# Altium schematic sheet MCUSetup.SchDoc
size A4
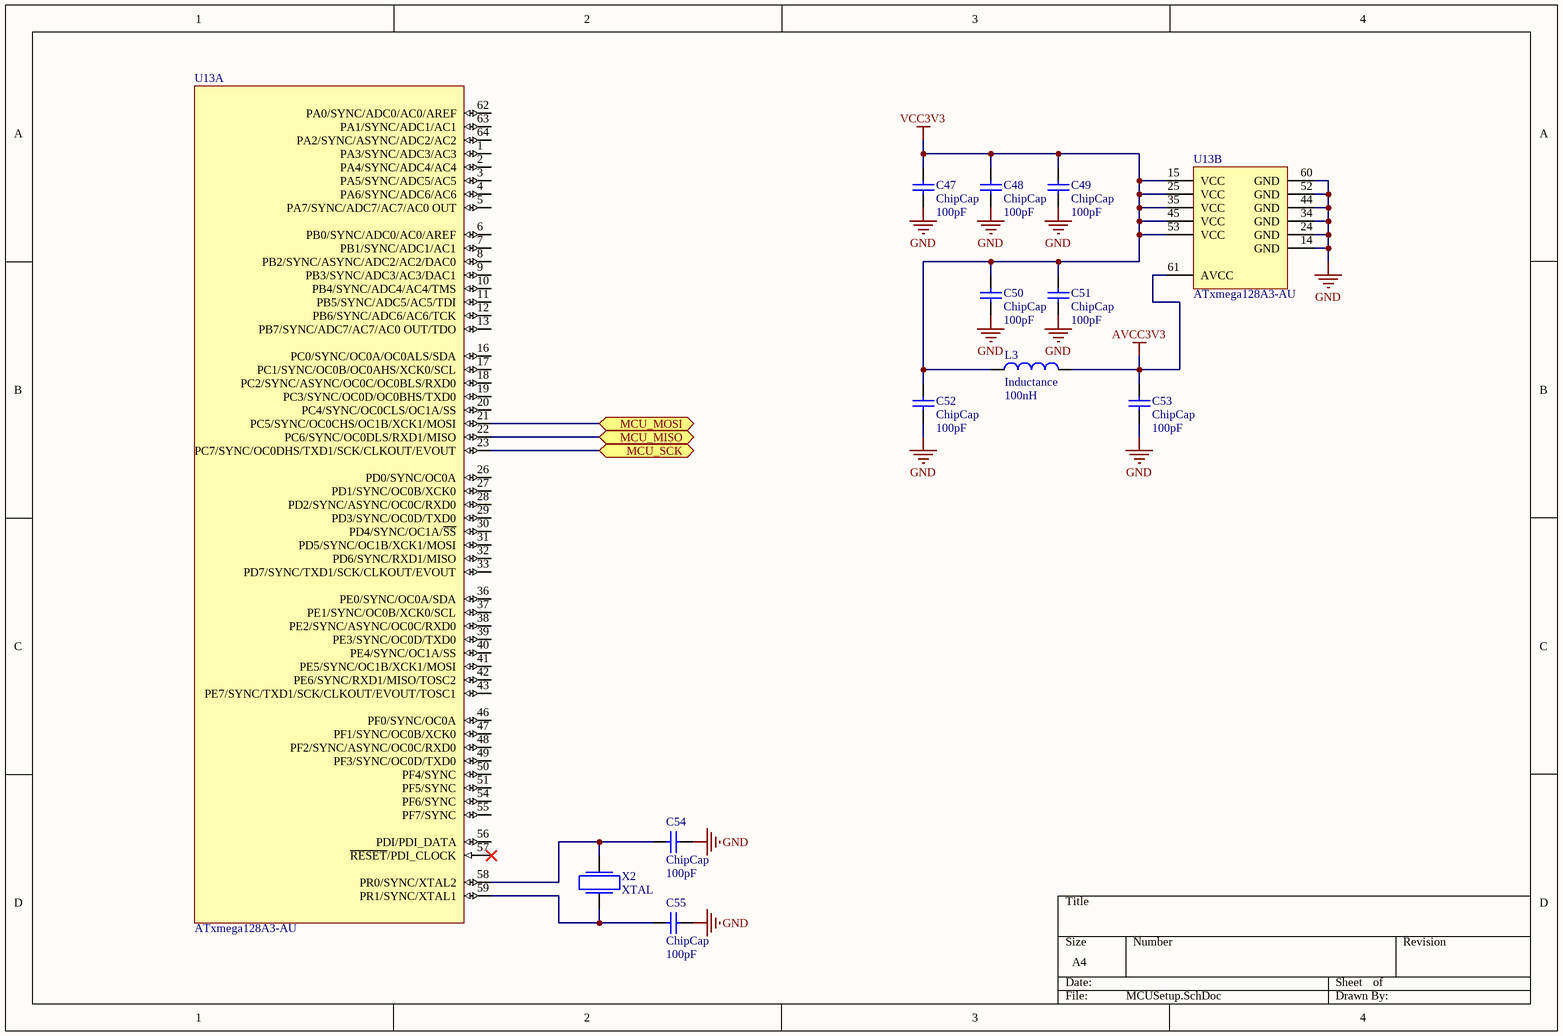
[diagram p0: MCUSetup.SchDoc]

## Parts
C47  ChipCap  value 100pF  [CAP0805]
C48  ChipCap  value 100pF  [CAP0805]
C49  ChipCap  value 100pF  [CAP0805]
C50  ChipCap  value 100pF  [CAP0805]
C51  ChipCap  value 100pF  [CAP0805]
C52  ChipCap  value 100pF  [CAP0805]
C53  ChipCap  value 100pF  [CAP0805]
C54  ChipCap  value 100pF  [CAP0805]
C55  ChipCap  value 100pF  [CAP0805]
L3  Inductance  value 100nH  [CM45]
U13  ATxmega128A3-AU  [64A_N]  (parts A,B of 2)
X2  XTAL  [BCY-W2/E4.7]

## Ports
MCU_MISO, MCU_MOSI, MCU_SCK

## Nets
AVCC3V3: C53.2 L3.1 U13.61(AVCC)
GND: C47.1 C48.1 C49.1 C50.1 C51.1 C52.1 C53.1 C54.2 C55.2 U13.14(GND) U13.24(GND) U13.34(GND) U13.44(GND) U13.52(GND) U13.60(GND)
VCC3V3: C47.2 C48.2 C49.2 C50.2 C51.2 C52.2 L3.2 U13.15(VCC) U13.25(VCC) U13.35(VCC) U13.45(VCC) U13.53(VCC)
MCU_MISO: U13.22(PC6/SYNC/OC0DLS/RXD1/MISO) ; port MCU_MISO
MCU_MOSI: U13.21(PC5/SYNC/OC0CHS/OC1B/XCK1/MOSI) ; port MCU_MOSI
MCU_SCK: U13.23(PC7/SYNC/OC0DHS/TXD1/SCK/CLKOUT/EVOUT) ; port MCU_SCK
NetC54_1: C54.1 U13.58(PR0/SYNC/XTAL2) X2.2
NetC55_1: C55.1 U13.59(PR1/SYNC/XTAL1) X2.1

Not connected (* = marked no-connect by the designer): U13 1(PA3/SYNC/ADC3/AC3) 2(PA4/SYNC/ADC4/AC4) 3(PA5/SYNC/ADC5/AC5) 4(PA6/SYNC/ADC6/AC6) 5(PA7/SYNC/ADC7/AC7/AC0_OUT) 6(PB0/SYNC/ADC0/AC0/AREF) 7(PB1/SYNC/ADC1/AC1) 8(PB2/SYNC/ASYNC/ADC2/AC2/DAC0) 9(PB3/SYNC/ADC3/AC3/DAC1) 10(PB4/SYNC/ADC4/AC4/TMS) 11(PB5/SYNC/ADC5/AC5/TDI) 12(PB6/SYNC/ADC6/AC6/TCK) 13(PB7/SYNC/ADC7/AC7/AC0_OUT/TDO) 16(PC0/SYNC/OC0A/OC0ALS/SDA) 17(PC1/SYNC/OC0B/OC0AHS/XCK0/SCL) 18(PC2/SYNC/ASYNC/OC0C/OC0BLS/RXD0) 19(PC3/SYNC/OC0D/OC0BHS/TXD0) 20(PC4/SYNC/OC0CLS/OC1A/SS) 26(PD0/SYNC/OC0A) 27(PD1/SYNC/OC0B/XCK0) 28(PD2/SYNC/ASYNC/OC0C/RXD0) 29(PD3/SYNC/OC0D/TXD0) 30(PD4/SYNC/OC1A/~{SS}) 31(PD5/SYNC/OC1B/XCK1/MOSI) 32(PD6/SYNC/RXD1/MISO) 33(PD7/SYNC/TXD1/SCK/CLKOUT/EVOUT) 36(PE0/SYNC/OC0A/SDA) 37(PE1/SYNC/OC0B/XCK0/SCL) 38(PE2/SYNC/ASYNC/OC0C/RXD0) 39(PE3/SYNC/OC0D/TXD0) 40(PE4/SYNC/OC1A/SS) 41(PE5/SYNC/OC1B/XCK1/MOSI) 42(PE6/SYNC/RXD1/MISO/TOSC2) 43(PE7/SYNC/TXD1/SCK/CLKOUT/EVOUT/TOSC1) 46(PF0/SYNC/OC0A) 47(PF1/SYNC/OC0B/XCK0) 48(PF2/SYNC/ASYNC/OC0C/RXD0) 49(PF3/SYNC/OC0D/TXD0) 50(PF4/SYNC) 51(PF5/SYNC) 54(PF6/SYNC) 55(PF7/SYNC) 56(PDI/PDI_DATA) 57(~{RESET}/PDI_CLOCK)* 62(PA0/SYNC/ADC0/AC0/AREF) 63(PA1/SYNC/ADC1/AC1) 64(PA2/SYNC/ASYNC/ADC2/AC2)

## Library data of the parts
C47-C55 = ChipCap: Capacitor; Published: 8-Jun-2000; LatestRevisionDate: 17-Jul-2002; LatestRevisionNote: Re-released for DXP Platform.; PackageReference: RAD-0.3; Publisher: Altium Limited
L3 = ChipInductance
U13 = ATxmega128A3-AU: 8/16-bit AVR XMEGA A3 Microcontroller, 1.6-3.6V, 128KB + 8KB Flash, 2KB EEPROM, 8KB SRAM, 64-pin TQFP, Industrial Grade (-40°C to 85°C), Pb-Free; Published: 1-Apr-2010; DatasheetVersion: revQ, Feb-2010; PackageVersion: revB, Oct-2001; PackageReference: 64A; Publisher: Altium Limited; PackageDescription: 64-Pin Plastic Thin Profile Quad Flat Pack, 14 x 14 x 1.0 mm Body, 0.8 mm Pitch (TQFP); Supplier 1: Digi-Key; Supplier Part Number 1: ATXMEGA128A3-AU-ND; Supplier 2: Farnell; Supplier Part Number 2: 1748550; Supplier 3: Mouser; Supplier Part Number 3: 556-ATXMEGA128A3-AU; Code_JEDEC: MS-026-AEB; ComponentLink1Description: Manufacturer Link; ComponentLink1URL: http://www.atmel.com/products/avr/default.asp?; ComponentLink2Description: ATxmega64A3/128A3/192A3/256A3 Datasheet; ComponentLink2URL: http://www.atmel.com/dyn/resources/prod_documents/doc8068.pdf; ComponentLink3Description: Atmel.com Home; ComponentLink3URL: http://www.atmel.com
X2 = Crystall oscillator: Quartz crystall oscillator